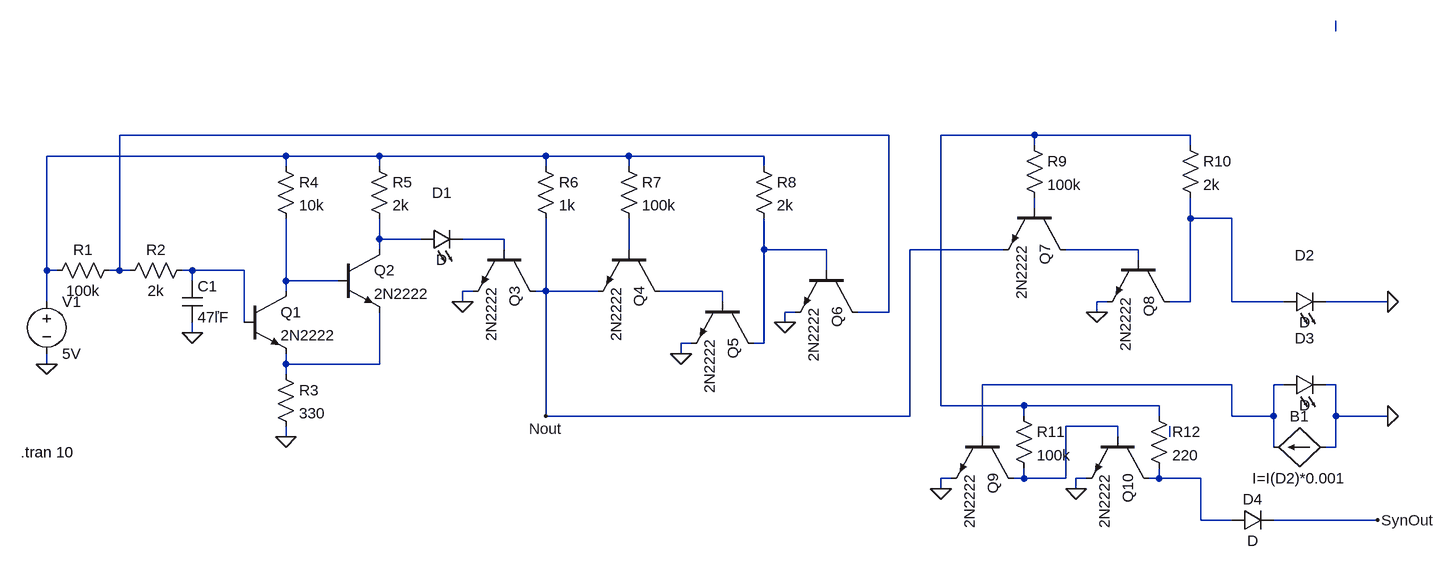
[diagram p0: schematic NeuronV1.asc]
NeuronV1.asc, the LTspice schematic file:
Version 4.1
SHEET 1 2296 680
WIRE 2128 -288 2128 -304
WIRE 1440 -128 256 -128
WIRE 1664 -128 1520 -128
WIRE 1904 -128 1664 -128
WIRE 1664 -112 1664 -128
WIRE 1904 -112 1904 -128
WIRE 512 -96 144 -96
WIRE 656 -96 512 -96
WIRE 912 -96 656 -96
WIRE 1040 -96 912 -96
WIRE 1248 -96 1040 -96
WIRE 512 -80 512 -96
WIRE 656 -80 656 -96
WIRE 912 -80 912 -96
WIRE 1040 -80 1040 -96
WIRE 1248 -80 1248 -96
WIRE 1664 -16 1664 -32
WIRE 1904 0 1904 -32
WIRE 1968 0 1904 0
WIRE 656 32 656 0
WIRE 720 32 656 32
WIRE 848 32 784 32
WIRE 656 48 656 32
WIRE 848 48 848 32
WIRE 1040 48 1040 0
WIRE 1248 48 1248 0
WIRE 1344 48 1248 48
WIRE 1616 48 1472 48
WIRE 1824 48 1712 48
WIRE 1824 64 1824 48
WIRE 144 80 144 -96
WIRE 160 80 144 80
WIRE 256 80 256 -128
WIRE 256 80 240 80
WIRE 272 80 256 80
WIRE 368 80 352 80
WIRE 448 80 368 80
WIRE 1344 80 1344 48
WIRE 368 96 368 80
WIRE 512 96 512 0
WIRE 592 96 512 96
WIRE 512 112 512 96
WIRE 800 112 784 112
WIRE 912 112 912 0
WIRE 912 112 896 112
WIRE 992 112 912 112
WIRE 1184 112 1088 112
WIRE 144 128 144 80
WIRE 784 128 784 112
WIRE 1184 128 1184 112
WIRE 1776 128 1760 128
WIRE 1904 128 1904 0
WIRE 1904 128 1872 128
WIRE 1968 128 1968 0
WIRE 2048 128 1968 128
WIRE 2208 128 2112 128
WIRE 1296 144 1280 144
WIRE 1440 144 1440 -128
WIRE 1440 144 1392 144
WIRE 1760 144 1760 128
WIRE 448 160 448 80
WIRE 1280 160 1280 144
WIRE 368 176 368 160
WIRE 1136 192 1120 192
WIRE 1248 192 1248 48
WIRE 1248 192 1232 192
WIRE 1120 208 1120 192
WIRE 144 224 144 208
WIRE 512 224 512 208
WIRE 656 224 656 144
WIRE 656 224 512 224
WIRE 512 240 512 224
WIRE 1968 256 1584 256
WIRE 2048 256 2032 256
WIRE 2128 256 2112 256
WIRE 1520 288 1520 -128
WIRE 1648 288 1520 288
WIRE 1856 288 1648 288
WIRE 912 304 912 112
WIRE 1472 304 1472 48
WIRE 1472 304 912 304
WIRE 1648 304 1648 288
WIRE 1856 304 1856 288
WIRE 1968 304 1968 256
WIRE 2032 304 2032 256
WIRE 2032 304 1968 304
WIRE 2128 304 2128 256
WIRE 2208 304 2128 304
WIRE 1792 320 1712 320
WIRE 512 336 512 320
WIRE 1584 336 1584 256
WIRE 1792 336 1792 320
WIRE 1872 336 1872 320
WIRE 2032 352 2032 304
WIRE 2128 352 2128 304
WIRE 2128 352 2112 352
WIRE 1536 400 1520 400
WIRE 1648 400 1648 384
WIRE 1648 400 1632 400
WIRE 1712 400 1712 320
WIRE 1712 400 1648 400
WIRE 1744 400 1728 400
WIRE 1856 400 1856 384
WIRE 1856 400 1840 400
WIRE 1920 400 1856 400
WIRE 1520 416 1520 400
WIRE 1728 416 1728 400
WIRE 1920 464 1920 400
WIRE 1968 464 1920 464
WIRE 2192 464 2032 464
FLAG 144 224 0
FLAG 368 176 0
FLAG 512 336 0
FLAG 784 128 0
FLAG 1120 208 0
FLAG 1280 160 0
FLAG 1760 144 0
FLAG 2208 128 0
FLAG 2208 304 0
FLAG 1520 416 0
FLAG 1728 416 0
FLAG 2192 464 SynOut
FLAG 912 304 Nout
SYMBOL voltage 144 112 R0
WINDOW 123 0 0 Left 0
WINDOW 39 0 0 Left 0
SYMATTR InstName V1
SYMATTR Value 5V
SYMBOL res 256 64 R90
WINDOW 0 0 56 VBottom 2
WINDOW 3 32 56 VTop 2
SYMATTR InstName R1
SYMATTR Value 100k
SYMBOL res 368 64 R90
WINDOW 0 0 56 VBottom 2
WINDOW 3 32 56 VTop 2
SYMATTR InstName R2
SYMATTR Value 2k
SYMBOL cap 352 96 R0
SYMATTR InstName C1
SYMATTR Value 47ľF
SYMBOL npn 448 112 R0
SYMATTR InstName Q1
SYMATTR Value 2N2222
SYMBOL res 496 224 R0
SYMATTR InstName R3
SYMATTR Value 330
SYMBOL npn 592 48 R0
SYMATTR InstName Q2
SYMATTR Value 2N2222
SYMBOL res 640 -96 R0
SYMATTR InstName R5
SYMATTR Value 2k
SYMBOL res 496 -96 R0
SYMATTR InstName R4
SYMATTR Value 10k
SYMBOL LED 720 48 R270
WINDOW 0 72 32 VTop 2
WINDOW 3 0 32 VBottom 2
SYMATTR InstName D1
SYMBOL npn 896 48 R90
SYMATTR InstName Q3
SYMATTR Value 2N2222
SYMBOL res 896 -96 R0
SYMATTR InstName R6
SYMATTR Value 1k
SYMBOL npn 1088 48 R90
SYMATTR InstName Q4
SYMATTR Value 2N2222
SYMBOL res 1024 -96 R0
SYMATTR InstName R7
SYMATTR Value 100k
SYMBOL npn 1232 128 R90
SYMATTR InstName Q5
SYMATTR Value 2N2222
SYMBOL res 1232 -96 R0
SYMATTR InstName R8
SYMATTR Value 2k
SYMBOL npn 1392 80 R90
SYMATTR InstName Q6
SYMATTR Value 2N2222
SYMBOL res 1648 -128 R0
SYMATTR InstName R9
SYMATTR Value 100k
SYMBOL npn 1712 -16 R90
SYMATTR InstName Q7
SYMATTR Value 2N2222
SYMBOL npn 1872 64 R90
SYMATTR InstName Q8
SYMATTR Value 2N2222
SYMBOL res 1888 -128 R0
SYMATTR InstName R10
SYMATTR Value 2k
SYMBOL LED 2048 272 R270
WINDOW 0 72 32 VTop 2
WINDOW 3 0 32 VBottom 2
SYMATTR InstName D3
SYMBOL res 1632 288 R0
SYMATTR InstName R11
SYMATTR Value 100k
SYMBOL res 1840 288 R0
SYMATTR InstName R12
SYMATTR Value 220
SYMBOL npn 1632 336 R90
SYMATTR InstName Q9
SYMATTR Value 2N2222
SYMBOL npn 1840 336 R90
SYMATTR InstName Q10
SYMATTR Value 2N2222
SYMBOL diode 1968 480 R270
WINDOW 0 32 32 VTop 2
WINDOW 3 0 32 VBottom 2
SYMATTR InstName D4
SYMBOL LED 2048 144 R270
WINDOW 0 72 32 VTop 2
WINDOW 3 0 32 VBottom 2
SYMATTR InstName D2
SYMBOL bi 2112 352 R90
WINDOW 0 -32 40 VBottom 2
WINDOW 3 32 40 VTop 2
SYMATTR InstName B1
SYMATTR Value I=I(D2)*0.001
TEXT 104 360 Left 2 !.tran 10

The netlist it stands for:
* NeuronV1.asc
V1 N004 0 5V
R1 N002 N004 100k
R2 N012 N002 2k
C1 N012 0 47ľF
Q1 N013 N012 N015 0 2N2222
R3 N015 0 330
Q2 N007 N013 N015 0 2N2222
R5 N004 N007 2k
R4 N004 N013 10k
D1 N007 N008 D
Q3 Nout N008 0 0 2N2222
R6 N004 Nout 1k
Q4 N014 N009 Nout 0 2N2222
R7 N004 N009 100k
Q5 N010 N014 0 0 2N2222
R8 N004 N010 2k
Q6 N002 N010 0 0 2N2222
R9 N003 N005 100k
Q7 N011 N005 Nout 0 2N2222
Q8 N006 N011 0 0 2N2222
R10 N003 N006 2k
D3 N016 0 D
R11 N003 N017 100k
R12 N003 N019 220
Q9 N017 N016 0 0 2N2222
Q10 N019 N017 0 0 2N2222
D4 N019 SynOut D
D2 N006 0 D
B1 0 N016 I=I(D2)*0.001
.model D D
.lib standard.dio
.model NPN NPN
.model PNP PNP
.lib standard.bjt
.tran 10
.backanno
.end